# EAGLE design LapCounter (EAGLE 7.6.0)
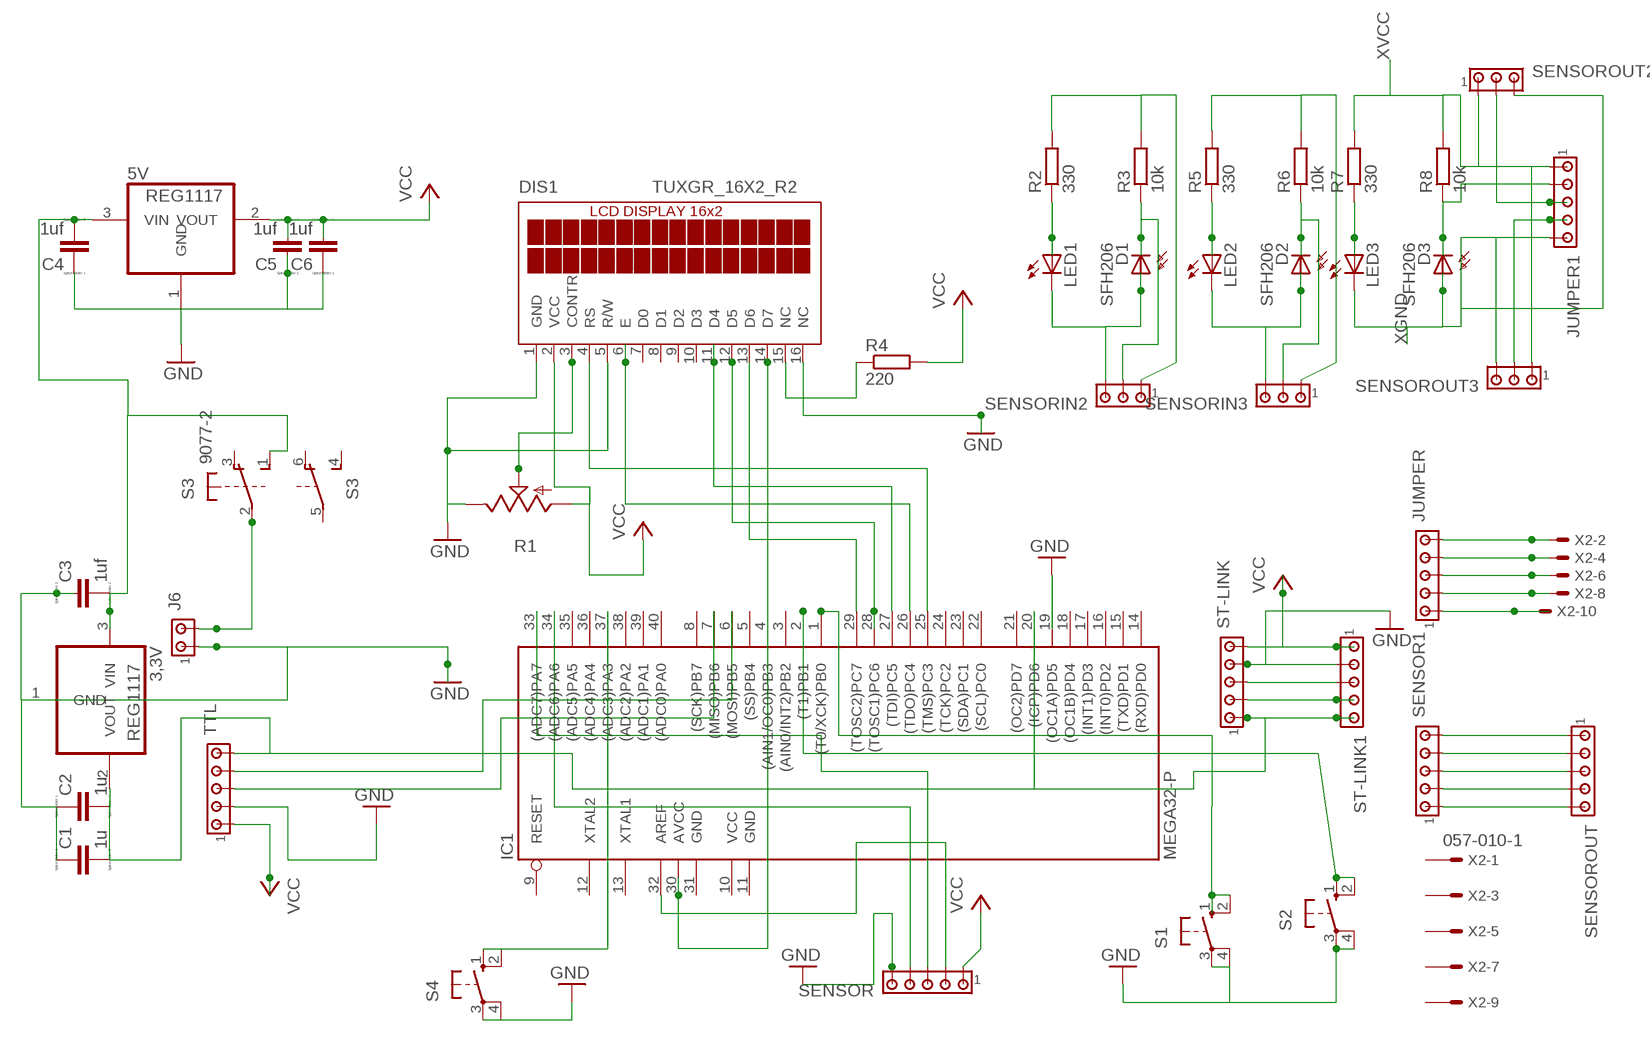
[diagram p0: schematic, sheet 1]

## Parts
3,3V  REG1117  [SOT223]
5V  REG1117  [SOT223]
C1  1u  C  [C0805]
C2  1u  C  [C0805]
C3  1uf  C  [C0805]
C4  1uf  C  [C0805]
C5  1uf  C  [C0805]
C6  1uf  C  [C0805]
D1  SFH206  [SFH206]
D2  SFH206  [SFH206]
D3  SFH206  [SFH206]
DIS1  TUXGR_16X2_R2  [TUXGR_16X2_R2]
IC1  MEGA32-P  [DIL40]
J6  MTA02-100  [10X02MTA]
JUMPER  MTA05-100  [10X05MTA]
JUMPER1  MTA05-100  [10X05MTA]
LED1  LED5MM  [LED5MM]
LED2  LED5MM  [LED5MM]
LED3  LED5MM  [LED5MM]
R1  TRIM_US-CA6V  [CA6V]
R2  330  R-EU_M1206  [M1206]
R3  10k  R-EU_M1206  [M1206]
R4  220  R-EU_M1206  [M1206]
R5  330  R-EU_M1206  [M1206]
R6  10k  R-EU_M1206  [M1206]
R7  330  R-EU_M1206  [M1206]
R8  10k  R-EU_M1206  [M1206]
S1  40-XX  [B3F-40XX]
S2  40-XX  [B3F-40XX]
S3  9077-2  [9077-2]
S4  40-XX  [B3F-40XX]
SENSOR  MTA05-100  [10X05MTA]
SENSOR1  MTA05-100  [10X05MTA]
SENSORIN2  MTA03-100  [10X03MTA]
SENSORIN3  MTA03-100  [10X03MTA]
SENSOROUT  MTA05-100  [10X05MTA]
SENSOROUT2  MTA03-100  [10X03MTA]
SENSOROUT3  MTA03-100  [10X03MTA]
ST-LINK  MTA05-100  [10X05MTA]
ST-LINK1  MTA05-100  [10X05MTA]
TTL  MTA05-100  [10X05MTA]
X2  057-010-1  [057-010-1]

## Nets
5V: J6.2 S3.2(1:P)
GND: 3,3V.1(GND) 5V.1(GND) C1.1 C2.1 C3.1 C4.1 C5.1 C6.1 DIS1.1(GND) DIS1.5(R/W) DIS1.16(NC) J6.1 R1.E S1.3(P) S1.4(P1) S2.3(P) S2.4(P1) S4.3(P) S4.4(P1) SENSOR.5 ST-LINK1.2 ST-LINK.4 TTL.2
N$1: DIS1.4(RS) IC1.25((TMS)PC3)
N$2: SENSOR1.5 SENSOROUT.1
N$3: DIS1.3(CONTR) R1.S
N$4: ST-LINK1.4 ST-LINK.2
N$5: DIS1.15(NC) R4.1
N$6: DIS1.6(E) IC1.26((TDO)PC4)
N$7: DIS1.11(D4) IC1.27((TDI)PC5)
N$8: DIS1.12(D5) IC1.28((TOSC1)PC6)
N$9: DIS1.13(D6) IC1.29((TOSC2)PC7)
N$10: DIS1.14(D7) IC1.30(AVCC)
N$11: ST-LINK1.3 ST-LINK.3
N$12: 3,3V.3(VIN) 5V.3(VIN) C3.2 C4.2 S3.1(1:S)
N$13: JUMPER.5 X2.2
N$14: JUMPER.4 X2.4
N$15: IC1.7((MISO)PB6) TTL.3
N$16: IC1.37((ADC3)PA3) S4.1(S) S4.2(S1)
N$17: IC1.33((ADC7)PA7) SENSOR.3
N$18: IC1.32(AREF) SENSOR.2
N$19: IC1.34((ADC6)PA6) SENSOR.4
N$21: SENSOR1.4 SENSOROUT.2
N$22: SENSOR1.3 SENSOROUT.3
N$23: JUMPER.3 X2.6
N$24: JUMPER.2 X2.8
N$25: IC1.6((MOSI)PB5) TTL.4
N$26: SENSOR1.2 SENSOROUT.4
N$27: JUMPER.1 X2.10
N$28: IC1.1((T0/XCK)PB0) S1.1(S) S1.2(S1)
N$29: IC1.2((T1)PB1) S2.1(S) S2.2(S1)
N$30: 3,3V.2(VOUT) C1.2 C2.2 IC1.20((ICP)PD6) ST-LINK1.5 ST-LINK.1 TTL.5
N$31: SENSOR1.1 SENSOROUT.5
N$70: D1.A LED1.K(C) SENSORIN2.3
N$71: LED1.A R2.1
N$72: D1.K(C) R3.1 SENSORIN2.2
N$73: R2.2 R3.2 SENSORIN2.1
N$74: D2.A LED2.K(C) SENSORIN3.3
N$75: LED2.A R5.1
N$76: D2.K(C) R6.1 SENSORIN3.2
N$77: R5.2 R6.2 SENSORIN3.1
N$79: LED3.A R7.1
N$80: D3.K(C) JUMPER1.2 R8.1
N$86: JUMPER1.4 SENSOROUT3.2
N$87: JUMPER1.3 SENSOROUT2.2
VCC: 5V.2(VOUT) C5.2 C6.2 DIS1.2(VCC) R1.A R4.2 SENSOR.1 ST-LINK1.1 ST-LINK.5 TTL.1
XGND: D3.A JUMPER1.5 LED3.K(C) SENSOROUT2.3 SENSOROUT3.3
XVCC: JUMPER1.1 R7.2 R8.2 SENSOROUT2.1 SENSOROUT3.1
Unconnected: DIS1.7(D0) DIS1.8(D1) DIS1.9(D2) DIS1.10(D3) IC1.3((AIN0/INT2)PB2) IC1.4((AIN1/OC0)PB3) IC1.5((SS)PB4) IC1.8((SCK)PB7) IC1.9(RESET) IC1.12(XTAL2) IC1.13(XTAL1) IC1.14((RXD)PD0) IC1.15((TXD)PD1) IC1.16((INT0)PD2) IC1.17((INT1)PD3) IC1.18((OC1B)PD4) IC1.19((OC1A)PD5) IC1.21((OC2)PD7) IC1.22((SCL)PC0) IC1.23((SDA)PC1) IC1.24((TCK)PC2) IC1.35((ADC5)PA5) IC1.36((ADC4)PA4) IC1.38((ADC2)PA2) IC1.39((ADC1)PA1) IC1.40((ADC0)PA0) S3.3(1:O) S3.4(2:S) S3.5(2:P) S3.6(2:O) X2.1 X2.3 X2.5 X2.7 X2.9

## Power pins joined to a net without a drawn wire
GND: IC1.11(GND) IC1.31(GND)
VCC: IC1.10(VCC)

## Library data of the parts
3,3V 5V = burr-brown:REG1117: 800mA and 1A Low Dropout (LDO) Positive Regulator 1.8V, 2.5V, 2.85V, 3.3V, 5V, and Adj; MPN: REG1117; OC_FARNELL: 1097566; OC_NEWARK: 14P6981
C1-C6 = eagle-ltspice:C: CAPACITOR, European symbol; SPICEMODEL: NONE; SPICEPREFIX: C
D1-D3 = opto-trans-siemens:SFH206: PHOTO DIODE; MPN: SFH206K; OC_FARNELL: 1212741; OC_NEWARK: 01M8807
DIS1 = display-lcd:TUXGR_16X2_R2: Tuxgraphics LCD display 16x2 characters reflective, without background light Source: tuxgr_12x2_r2.pdf; OC_FARNELL: unknown; OC_NEWARK: unknown
IC1 = atmel:MEGA32-P: MICROCONTROLLER 32 Kbytes FLASH 2 Kbytes SRAM 1 Kbytes EEPROM USART 8-channel 10 bit ADC Source: www.atmel.com .. doc2503.pdf; MPN: ATMEGA32-16PU; OC_FARNELL: 1661729; OC_NEWARK: 51P1794
J6 = con-amp:MTA02-100: AMP connector
JUMPER JUMPER1 SENSOR SENSOR1 SENSOROUT ST-LINK ST-LINK1 TTL = con-amp:MTA05-100: AMP connector
LED1-LED3 = led:LED: LED OSRAM: - CHIPLED LG R971, LG N971, LY N971, LG Q971, LY Q971, LO R971, LY R971 LH N974, LH R974 LS Q976, LO Q976, LY Q976 LO Q996 - Hyper CHIPLED LW Q18S LB Q993, LB Q99A, LB R99A - SideLED LS A670, LO A670, LY A670, LG A670, LP A670 LB A673, LV A673, LT A673, LW A673 LH A674 LY A675 LS A676, LA A676, LO A676, LY A676, LW A676 LS A679, LY A679, LG A679 - Hyper Micro SIDELED® LS Y876, LA Y876, LO Y876, LY Y876 LT Y87S - SmartLED LW L88C, LW L88S LB L89C, LB L89S, LG L890 LS L89K, LO L89K, LY L89K LS L896, LA L896, LO L896, LY L896 - TOPLED LS T670, LO T670, LY T670, LG T670, LP T670 LSG T670, LSP T670, LSY T670, LOP T670, LYG T670 LG T671, LOG T671, LSG T671 LB T673, LV T673, LT T673, LW T673 LH T674 LS T676, LA T676, LO T676, LY T676, LB T676, LH T676, LSB T676, LW T676 LB T67C, LV T67C, LT T67C, LS T67K, LO T67K, LY T67K, LW E67C LS E67B, LA E67B, LO E67B, LY E67B, LB E67C, LV E67C, LT E67C LW T67C LS T679, LY T679, LG T679 LS T770, LO T770, LY T770, LG T770, LP T770 LB T773, LV T773, LT T773, LW T773 LH T774 LS E675, LA E675, LY E675, LS T675 LS T776, LA T776, LO T776, LY T776, LB T776 LHGB T686 LT T68C, LB T68C - Hyper Mini TOPLED® LB M676 - Mini TOPLED Santana® LG M470 LS M47K, LO M47K, LY M47K Source: http://www.osram.convergy.de LUXEON: - LUMILED® LXK2-PW12-R00, LXK2-PW12-S00, LXK2-PW14-U00, LXK2-PW14-V00 LXK2-PM12-R00, LXK2-PM12-S00, LXK2-PM14-U00 LXK2-PE12-Q00, LXK2-PE12-R00, LXK2-PE12-S00, LXK2-PE14-T00, LXK2-PE14-U00 LXK2-PB12-K00, LXK2-PB12-L00, LXK2-PB12-M00, LXK2-PB14-N00, LXK2-PB14-P00, LXK2-PB14-Q00 LXK2-PR12-L00, LXK2-PR12-M00, LXK2-PR14-Q00, LXK2-PR14-R00 LXK2-PD12-Q00, LXK2-PD12-R00, LXK2-PD12-S00 LXK2-PH12-R00, LXK2-PH12-S00 LXK2-PL12-P00, LXK2-PL12-Q00, LXK2-PL12-R00 Source: www.luxeon.com KINGBRIGHT: KA-3528ASYC Source: www.kingbright.com
R1 = pot:TRIM_US-: POTENTIOMETER
R2-R8 = rcl:R-EU_: RESISTOR, European symbol
S1 S2 S4 = switch-omron:40-XX: OMRON SWITCH; MF: OMRON COMPONENTS USA; MPN: B3F-4000; OC_FARNELL: 176434; OC_NEWARK: 36K3105
S3 = switch-misc:9077-2: MARQUARDT SWITCH 9077.0200 Distributor: Buerklin <https://www.buerklin.com/default.asp?event=ShowArtikel%2812G2822%29&l=d&jump=ArtNr_12G2822>
SENSORIN2 SENSORIN3 SENSOROUT2 SENSOROUT3 = con-amp:MTA03-100: AMP connector
X2 = con-panduit:057-010-: CONNECTOR 10-pin series 057 contact pc board low profile headers; OC_FARNELL: unknown; OC_NEWARK: unknown

## Board
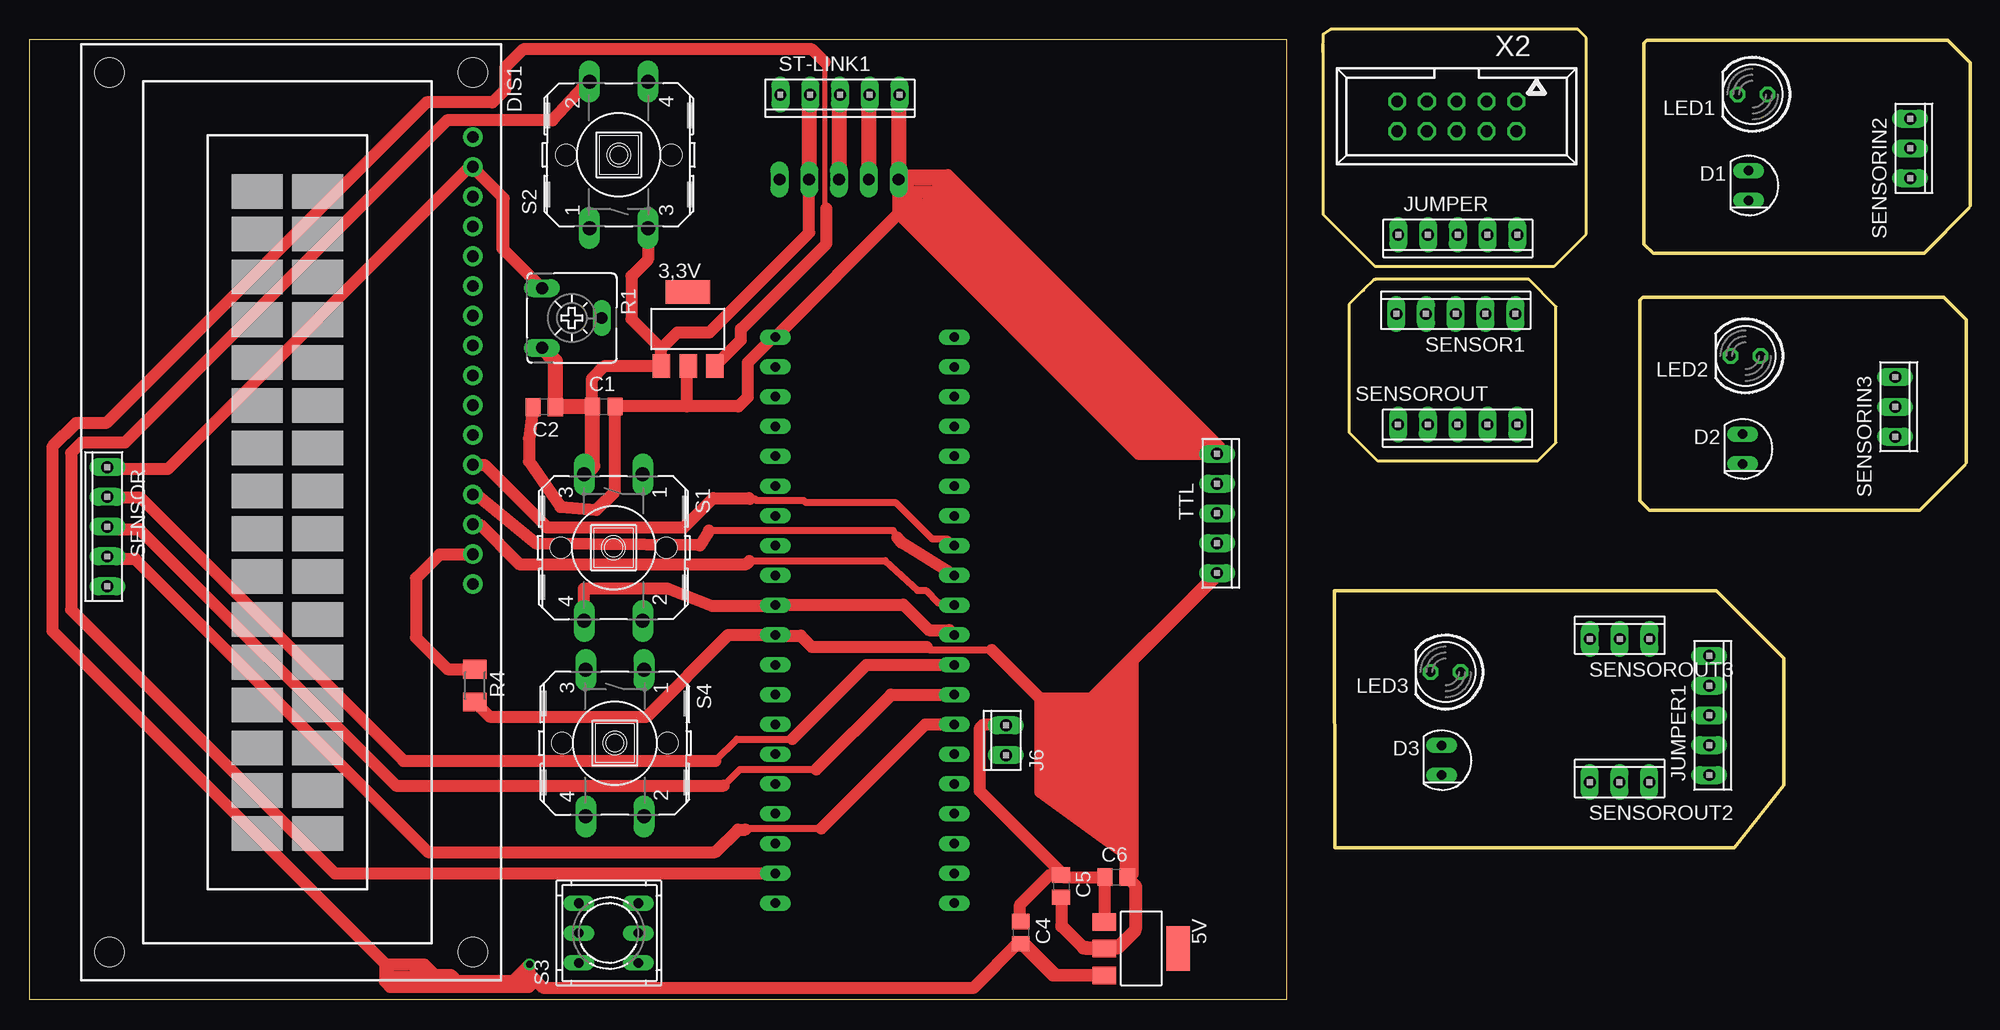
[diagram p1: board, top side]
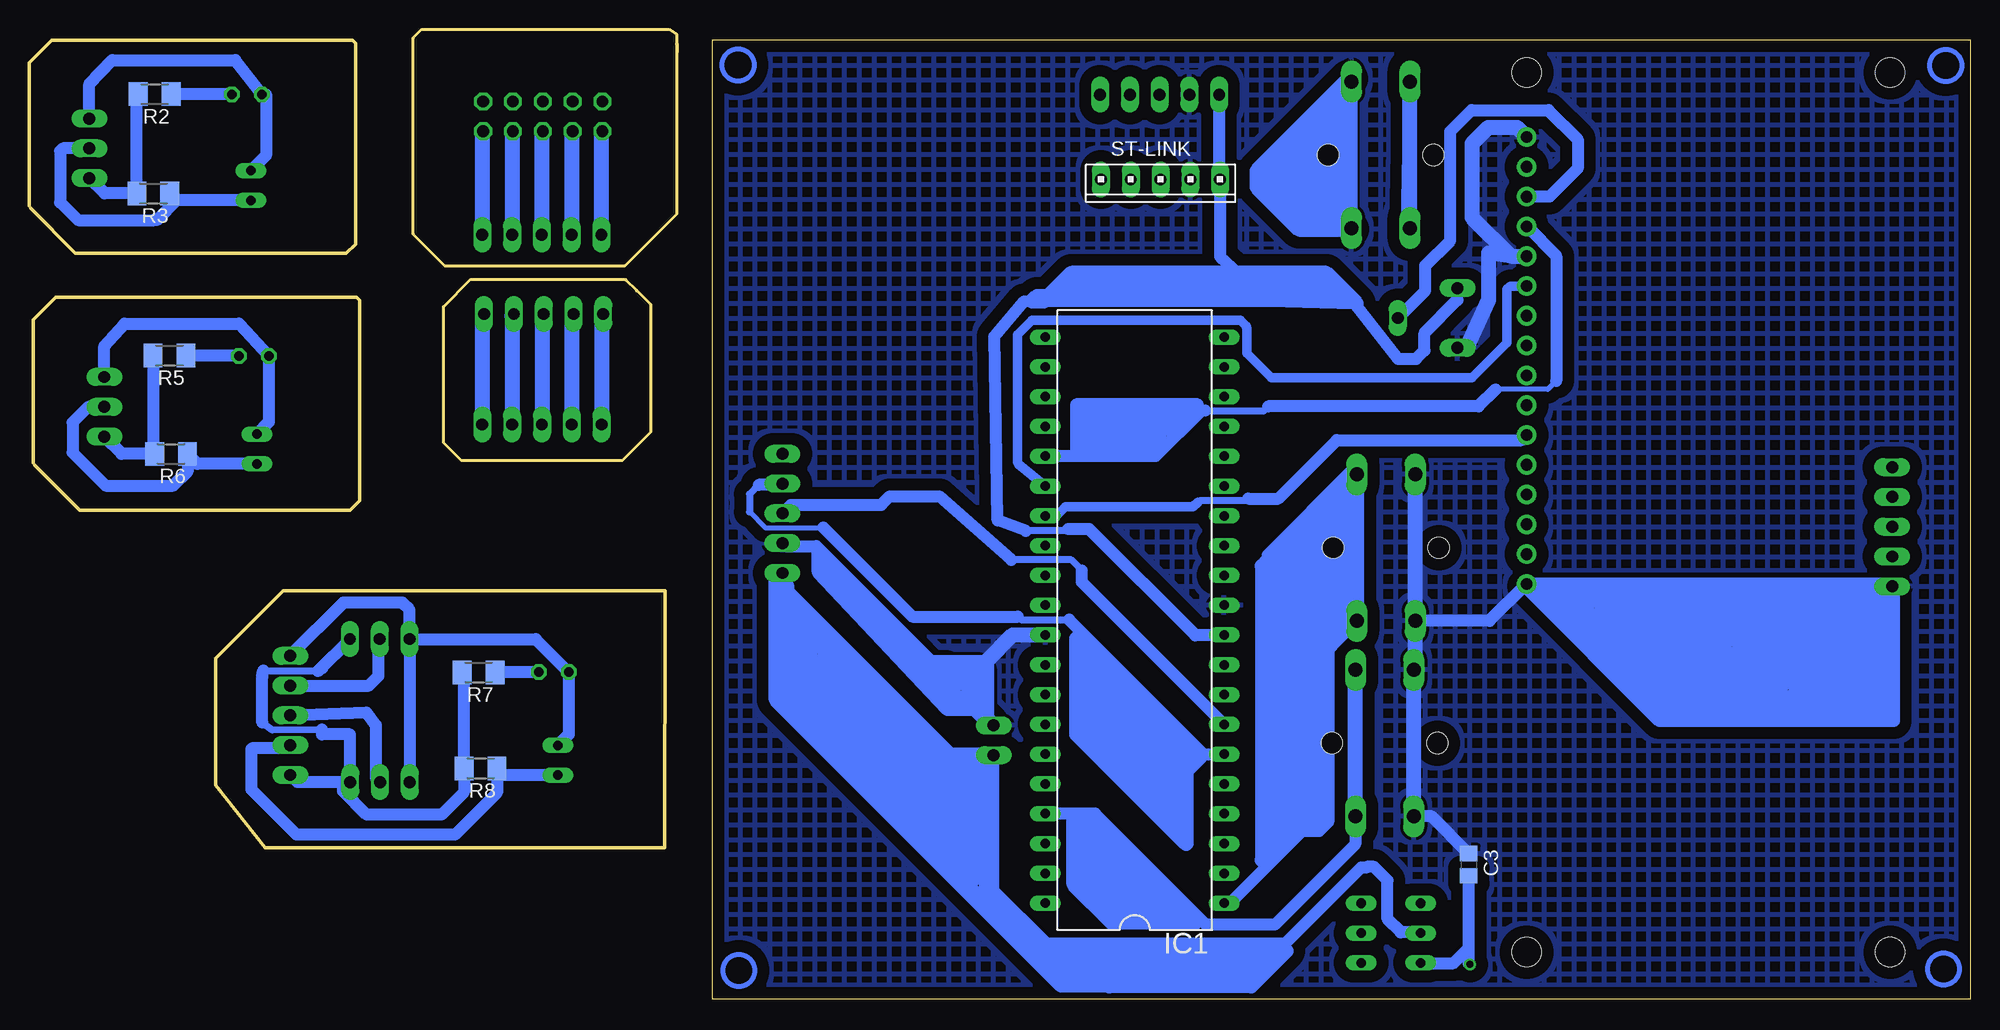
[diagram p2: board, bottom side, seen from below]

Size 165.52 x 82.68 mm. Coordinates in mm from the lower left corner, seen from the top.
Outline: 110.34,81.42 110.34,66.9 114.74,62.5 130.06,62.5 132.78,65.21 132.78,81.94 132.04,82.68 110.96,82.68 110.34,82.26 110.29,80.73
Outline: 113.79,60.48 112.55,59.23 112.55,48.31 114.96,45.9 128.65,45.9 130.19,47.43 130.19,59.03 127.86,61.35 114.81,61.35 114.8,61.37 114.66,61.34 113.79,60.48
Outline: 113.79,60.48 113.72,60.36
Outline: 137.71,81.34 137.71,64.36 138.48,63.59 161.58,63.59 165.42,67.42
Outline: 165.52,67.61 165.52,79.81 163.6,81.72 137.95,81.72 137.69,81.47
Outline: 137.36,59.45 137.36,42.47 138.14,41.69 161.24,41.69 165.07,45.53
Outline: 165.18,45.72 165.18,57.91 163.26,59.83 137.6,59.83 137.35,59.58
Outline: 0,0 107.23,0 107.23,81.8 0,81.8 0,0
Outline: 111.29,34.78 111.29,34.05 111.33,12.89 145.41,12.89 149.63,18.21 149.63,29.06 143.88,34.81 111.32,34.81 111.29,34.78
Copper layers (1*16): Top 0.035mm / dielectric 1.5mm / Bottom 0.035mm
Design rules "default": minimum track width 10mil, minimum drill 24mil, track to track 8mil, track to pad 8mil, pad to pad 8mil, via to via 8mil, smd to smd 8mil, copper to edge 40mil, drill to drill 8mil, minimum pad ring 10mil, minimum via ring 8mil, stop-mask expansion 4mil, vias tented up to drill 0mil, thermal gap 10mil

### Footprints (pad centres in the part's own frame; a part is rotated, then mirrored left to right if it is on the bottom)
SOT223 = smd 1.499 x 2.007: 1 -2.261,-3.15; 2 0.025,-3.15; 3 2.311,-3.15 | smd 3.81 x 2.007: 4 0,3.15
C0805 = smd 1.3 x 1.5: 1 -0.95,0; 2 0.95,0
SFH206 = drill 0.813 long: A 0,-1.27; K 0,1.27
TUXGR_16X2_R2 = drill 1 pad 1.676: 1 -32,15.5; 2 -29.46,15.5; 3 -26.92,15.5; 4 -24.38,15.5; 5 -21.84,15.5; 6 -19.3,15.5; 7 -16.76,15.5; 8 -14.22,15.5; 9 -11.68,15.5; 10 -9.14,15.5; 11 -6.6,15.5; 12 -4.06,15.5; 13 -1.52,15.5; 14 1.02,15.5; 15 3.56,15.5; 16 6.1,15.5 | hole 2.5: -37.5,-15.5; 37.5,-15.5; -37.5,15.5; 37.5,15.5
DIL40 = drill 0.813 long: 1 -24.13,-7.62; 2 -21.59,-7.62; 3 -19.05,-7.62; 4 -16.51,-7.62; 5 -13.97,-7.62; 6 -11.43,-7.62; 7 -8.89,-7.62; 8 -6.35,-7.62; 9 -3.81,-7.62; 10 -1.27,-7.62; 11 1.27,-7.62; 12 3.81,-7.62; 13 6.35,-7.62; 14 8.89,-7.62; 15 11.43,-7.62; 16 13.97,-7.62; 17 16.51,-7.62; 18 19.05,-7.62; 19 21.59,-7.62; 20 24.13,-7.62; 21 24.13,7.62; 22 21.59,7.62; 23 19.05,7.62; 24 16.51,7.62; 25 13.97,7.62; 26 11.43,7.62; 27 8.89,7.62; 28 6.35,7.62; 29 3.81,7.62; 30 1.27,7.62; 31 -1.27,7.62; 32 -3.81,7.62; 33 -6.35,7.62; 34 -8.89,7.62; 35 -11.43,7.62; 36 -13.97,7.62; 37 -16.51,7.62; 38 -19.05,7.62; 39 -21.59,7.62; 40 -24.13,7.62
10X02MTA = drill 1.016 long: 1 1.27,0; 2 -1.27,0
10X05MTA = drill 1.016 long: 1 5.08,0; 2 2.54,0; 3 0,0; 4 -2.54,0; 5 -5.08,0
LED5MM = drill 0.813 octagon: A -1.27,0; K 1.27,0
CA6V = drill 1.016 long: A -2.54,-2.54; E 2.54,-2.54; S 0,2.54
M1206 = smd 1.6 x 2: 1 -1.4,0; 2 1.4,0
B3F-40XX = drill 1.194 long: 1 -6.248,2.489; 2 6.248,2.489; 3 -6.248,-2.489; 4 6.248,-2.489 | hole 1.803: 0,-4.496; 0,4.496
9077-2 = drill 0.813 long: 1 -2.54,2.54; 2 0,2.54; 3 2.54,2.54; 4 -2.54,-2.54; 5 0,-2.54; 6 2.54,-2.54
10X03MTA = drill 1.016 long: 1 2.54,0; 2 0,0; 3 -2.54,0
057-010-1 = drill 1 octagon: 1 -5.08,-1.27; 2 -5.08,1.27; 3 -2.54,-1.27; 4 -2.54,1.27; 5 0,-1.27; 6 0,1.27; 7 2.54,-1.27; 8 2.54,1.27; 9 5.08,-1.27; 10 5.08,1.27

### Placement (x,y rotation side)
3,3V  56.16,57.12 0 top
5V  94.83,4.32 270 top
C1  49,50.53 0 top
C2  43.9,50.46 180 top
C3  42.76,11.46 270 bottom
C4  84.56,5.66 270 top
C5  87.99,9.63 270 top
C6  92.68,10.4 0 top
D1  146.62,69.35 180 top
D2  146.11,46.9 180 top
D3  120.45,20.36 180 top
DIS1  22.33,41.49 270 top
IC1  71.25,32.31 90 bottom
J6  83.29,22.06 90 top
JUMPER  121.82,65.16 180 top
JUMPER1  143.26,24.18 270 top
LED1  146.95,77.14 180 top
LED2  146.35,54.84 180 top
LED3  120.78,27.88 180 top
R1  46.27,58.06 270 top
R2  154.83,77.15 180 bottom
R3  154.94,68.68 180 bottom
R4  38.01,26.72 270 top
R5  153.57,54.86 180 bottom
R6  153.43,46.48 180 bottom
R7  127.2,27.85 180 bottom
R8  127.04,19.67 180 bottom
S1  49.82,38.48 270 top
S2  50.27,71.97 90 top
S3  49.42,5.63 90 top
S4  49.94,21.82 270 top
SENSOR  6.65,40.27 90 top
SENSOR1  121.65,58.41 0 top
SENSORIN2  160.4,72.53 270 top
SENSORIN3  159.12,50.5 270 top
SENSOROUT  121.81,48.98 180 top
SENSOROUT2  135.61,18.49 0 top
SENSOROUT3  135.64,30.7 0 top
ST-LINK  69.05,69.88 180 bottom
ST-LINK1  69.13,77.11 180 top
TTL  101.3,41.4 270 top
X2  121.73,75.26 180 top

### Tracks (layer width: path | path; a pad name or v marks a point on that pad's centre or on a via)
5V
  Bottom 1.016: S3.2 46.93,5.68 48.55,5.68 49.7,6.82 49.7,10.11 50.85,11.26 51.46,11.26 51.51,11.21 51.94,11.21 58.45,4.71 78.79,4.71 83.29,9.21 J6.2
  Bottom 1.27: J6.2 83.31,20.76 87.01,20.76 101.3,35.05
GND
  Top 1.016: C5.1 88.16,10.4 C6.1 91.73,6.63 5V.1 | C4.1 84.51,6.66 84.51,8.04 87.04,10.58 C5.1 | C1.1 47.98,50.6 47.98,52.88 49.07,53.97 3,3V.1 53.87,54 53.87,55.44 | 53.87,55.44 55.27,56.83 58,56.83 66.51,65.34 ST-LINK.4 | S1.4 47.28,35 54.42,35 58.24,33.5 63.55,33.5 IC1.11 63.68,33.63 74.54,33.63 76.71,31.46 78.45,31.46 IC1.31 | J6.1 83.25,23.37 81.33,23.37 81.04,23.08 81.04,17.75 87.99,10.81 C5.1 | 53.87,55.44 51.35,57.96 51.35,61.63 52.76,63.04 S2.3
  Top 1.27: R1.E 44.85,54.4 C2.1 44.93,50.53 C1.1 48.05,45.44 S1.3 | ST-LINK1.2 66.51,77.04 ST-LINK.4
  Bottom 1.016: C3.1 45.93,15.57 S4.4 | S1.4 40.98,32.23 DIS1.16 6.85,35.39 SENSOR.5 | TTL.2 101.04,38.61 98.4,38.61 88.63,28.84 83.86,28.84 | S2.4 S2.3
  Bottom 1.27: J6.1 83.86,23.9 83.86,28.84 81.66,31.04 IC1.31 | DIS1.1 38.63,74.29 41.12,74.29 42.48,72.94 42.48,66.62 39.19,63.33 | 39.19,63.33 DIS1.5 | 39.19,63.33 41.07,63.62 41.07,59.6 42.98,55.52 R1.E | S4.4 S4.3 47.33,28.18 S1.4 S1.3
  pour Bottom (isolate 1.016, hatched): 0.03,0.14 107.23,0.14 107.23,81.9 -0.01,81.83
N$1
  Bottom 0.406: 35.29,52.7 36.02,51.98 40.46,51.98
  Bottom 0.61: 59.88,50.52 60.26,50.13 65.61,50.13
  Bottom 1.016: DIS1.4 35.29,63.34 35.29,52.7 | 40.46,51.98 41.92,50.52 59.88,50.52 | 65.61,50.13 69.47,46.28 IC1.25
N$2
  Bottom 1.27: SENSOR1.5 116.73,58.25 SENSOROUT.1
N$3
  Bottom 1.016: R1.S 46.47,60.4 46.47,62.55 44.35,64.67 44.35,73.98 42.53,75.79 35.97,75.79 33.48,73.3 33.48,70.81 35.88,68.41 DIS1.3
N$4
  Top 1.27: ST-LINK1.4 71.59,77.04 ST-LINK.2
N$5
  Top 1.016: DIS1.15 37.79,37.9 34.99,37.9 32.98,35.89 32.98,30.81 35.67,28.12 R4.1
N$6
  Bottom 0.813: DIS1.6 39.21,60.79 39.5,60.5 39.5,55.94 42.48,52.96 59.59,52.96 61.7,55.07 61.7,57.19 61.72,57.21 61.72,57.35 62.23,57.86 80,57.86 81.24,56.62 81.24,45.77 81.17,45.59 IC1.26
N$7
  Bottom 0.61: 65.87,42.35 65.85,42.35 65.68,42.52 61.7,42.52 61.56,42.66
  Bottom 0.813: IC1.27 77.9,41.2 77.14,41.96 66.27,41.96 65.87,42.35
  Bottom 1.016: 61.56,42.66 59,42.66 54.01,47.65 38.27,47.65 DIS1.11
N$8
  Top 0.61: 61.43,42.65 61.9,42.65 62.01,42.51 66.04,42.51 66.22,42.35 73.86,42.35 76.99,39.23 78.3,39.23 IC1.28
  Top 1.016: DIS1.12 38.82,45.55 44.15,40.22 55.83,40.22 58.32,42.71 61.37,42.71 61.43,42.65
N$9
  Top 0.61: 74,39.37 73.69,39.93 57.95,39.93
  Top 1.016: IC1.29 74.36,38.93 74,39.37 | 57.95,39.93 57.2,38.67 43.24,38.84 38.32,42.85 DIS1.13
N$10
  Top 0.61: 61.42,37.34 61.59,37.34 61.67,37.38 72.99,37.38 75.74,34.84 76.45,34.84 77.51,33.78 78.66,33.78 IC1.30
  Top 1.016: DIS1.14 38.38,40.47 41.77,37.08 61.16,37.08 61.42,37.34
N$11
  Top 1.27: ST-LINK1.3 69.05,77.04 ST-LINK.3
N$12  (via drill 0.6)
  Top 0.406: 67.98,67.41 67.84,67.55 67.84,79.88
  Top 1.016: C4.2 87.26,2.01 5V.3 91.66,2.03 87.59,2.03 84.8,4.83 84.38,4.83 80.49,0.94 43.87,0.94 42.66,2.15 v42.66,2.95 41.24,1.52 36.5,1.52 35.97,2.06 34.57,2.06 33.68,2.95 30.39,2.95 1.96,31.38 1.96,47.07 4,49.11 6.54,49.11 33.88,76.45 39.5,76.45 40.59,77.55 40.59,79.45 42.11,80.97 66.75,80.97 67.84,79.88 | 3,3V.3 60.69,56.2 60.69,57.12 67.98,64.41 67.98,67.41
  Bottom 1.016: S3.1 46.85,3.06 44.06,3.06 42.76,4.36 | 42.76,4.36 C3.2 | v42.66,2.95 42.76,3.05 42.76,4.36
N$13
  Bottom 1.27: X2.2 126.9,73.9 JUMPER.5
N$14
  Bottom 1.27: X2.4 124.36,73.9 JUMPER.4
N$15
  Bottom 0.61: 75.76,36.55 76.66,37.45 81.76,37.45
  Bottom 1.016: IC1.7 75.76,35.55 75.76,36.55 | 81.76,37.45 87.9,42.86 92.15,42.86 92.87,42.14 100.56,42.14 TTL.3
N$16
  Bottom 1.016: S4.2 52.44,15.56 52.44,13.21 59.3,6.35 65.19,6.35 74.64,15.8 IC1.37
  Bottom 1.27: S4.2 S4.1
N$17
  Top 0.61: 59.22,18.19 60.6,19.57 67.09,19.57
  Top 1.016: SENSOR.3 6.86,40.07 9.39,40.07 31.27,18.19 59.22,18.19 | 67.09,19.57 73.48,25.96 IC1.33
N$18
  Top 0.61: 58.5,20.31 60.35,22.16 65.05,22.16
  Top 1.016: SENSOR.2 6.71,42.76 9.46,42.76 31.92,20.31 58.5,20.31 | 65.05,22.16 71.39,28.5 IC1.32
N$19
  Top 0.61: 61.06,14.45 61.15,14.54 67.55,14.54
  Top 1.016: SENSOR.4 6.83,37.55 8.99,37.55 34.02,12.52 58.5,12.52 60.43,14.45 61.06,14.45 | 67.55,14.54 76.43,23.42 IC1.34
N$21
  Bottom 1.27: SENSOR1.4 119.27,58.25 SENSOROUT.2
N$22
  Bottom 1.27: SENSOR1.3 121.81,58.25 SENSOROUT.3
N$23
  Bottom 1.27: X2.6 121.82,73.9 JUMPER.3
N$24
  Bottom 1.27: X2.8 119.28,73.9 JUMPER.2
N$25
  Bottom 0.406: 104.11,41.53 102.78,40.2 97.8,40.2
  Bottom 0.61: 103.33,43.84 104.11,43.05 104.11,41.53 | 81.22,32.6 80.96,32.35 76.85,32.35
  Bottom 1.016: TTL.4 101.4,43.84 103.33,43.84 | 97.8,40.2 90.21,32.6 81.22,32.6 | 76.85,32.35 65.38,20.88 IC1.6
N$26
  Bottom 1.27: SENSOR1.2 124.35,58.25 SENSOROUT.4
N$27
  Bottom 1.27: X2.10 116.74,73.9 JUMPER.1
N$28
  Bottom 1.016: S1.2 54.74,29.81 54.74,15.1 55.52,14.31 56.98,14.31 63.12,8.18 IC1.1
  Bottom 1.27: S1.2 S1.1
N$29  (via drill 0.6)
  Top 1.016: v47.79,78.37 44.59,74.92 35.62,74.92 8.14,47.43 4.43,47.43 3.56,46.56 3.56,33.21 26.05,10.72 IC1.2
  Bottom 1.016: S2.1 48.02,65.96 v47.79,78.37
  Bottom 1.27: S2.1 S2.2
N$30
  Top 1.016: IC1.20 74.13,66.94 | 74.13,66.94 ST-LINK.1 | IC1.20 63.59,56.48 | 56.07,50.53 60.46,50.53 61.28,51.35 61.28,54.28 63.44,56.44 IC1.20 | 56.07,50.53 C1.2 49.95,43.3 48.35,41.71 45.3,41.96 42.62,45.83 42.61,47.77 C2.2 | 3,3V.2 56.07,53.86 56.07,50.53 | 74.13,66.94 94.59,46.48 TTL.5
  Top 1.27: ST-LINK1.5 74.13,77.04 ST-LINK.1
N$31
  Bottom 1.27: SENSOR1.1 126.89,58.25 SENSOROUT.5
N$32
  Bottom 1.27: 52.97,78.45 60.81,70.61 60.81,69.21 57.23,65.63 52.91,65.63 53.7,66.42 53.7,77.05 59.78,70.97 59.78,68.67 57.77,66.66 54.5,66.66 54.67,66.84 54.67,75.11 58.56,71.22 58.56,68.67 57.52,67.63 55.52,67.63 55.4,67.75 55.4,73.1 57.47,71.03 57.47,68.61 57.4,68.54 56.07,68.54 56.25,68.72 56.25,71.34
N$33
  Bottom 1.27: 52.36,59.31 54.91,61.86 76.66,61.86 79.02,59.5 80,59.5 79.58,59.92 53.95,59.92 54.86,60.83 76.9,60.83
N$34
  Bottom 1.27: 52.55,45.03 59.78,37.81 59.78,37.68 54.14,32.04 52.55,32.04 53.34,32.83 53.34,43.15 58.38,38.11 58.38,37.57 54.06,33.25 53.82,33.25 54.24,33.67 54.24,40.78 53.89,41.13 53.89,41.52 57.23,38.18 57.23,37.5 55.09,35.37 | 55.09,35.37 55.09,35.32 | 55.09,35.37 55.09,39.38 56.18,38.29 56.18,36.54
N$35
  Bottom 1.27: 59.96,37.32 60.38,36.91 60.38,11.87 56.92,15.33 55.7,15.33 55.52,15.51 55.52,29.18 54.55,30.16 54.55,31.31 59.65,36.41 59.65,36.54 59.52,36.41 59.52,12.9 56.49,15.94 56.49,29.06 58.62,26.92 58.62,14.72 57.47,15.87 57.47,27.18 58.01,27.72 58.93,27.72 58.56,28.09 58.56,34.65 55.64,31.72 55.64,29.43 56.49,30.28 56.49,31.91 57.16,32.59 57.71,32.59 57.58,32.46 57.58,28.94 56.92,29.6 56.92,29.84
N$36
  Bottom 1.27: 65.96,6.64 66.08,6.53 73.19,6.53 76.42,9.75 76.42,15.7 67.86,7.14 67.3,7.14 74.78,14.62 74.78,14.91 75.44,14.25 75.44,9.74 72.95,7.25 69.24,7.25 74.52,12.53 74.52,12.72 74.17,12.37 74.17,9.38 72.71,7.92 71.07,7.92 73.13,9.98 73.56,9.98
N$37
  Bottom 1.27: 65.72,20.61 66.88,19.46 | 66.88,19.46 66.88,19.04 | 66.88,19.04 66.88,13.27 76.17,22.57 76.17,30.76 66.88,21.46 66.88,19.46 | 66.88,19.04 67.42,18.49 67.42,14.36 75.26,22.2 75.26,29.12 67.91,21.77 67.91,17.03 68.4,16.53 68.4,15.21 68.95,15.76 68.95,21.41 74.52,26.99 74.52,27.36 74.04,26.87 74.04,22.11 69.82,17.89 69.51,17.89 70.19,18.58 70.19,21.4 73.11,24.32 73.46,24.32 73.08,23.94 73.08,21.59 71.79,20.31 70.43,20.31 72.21,22.08 72.63,22.08
N$38
  Bottom 1.27: 58.34,4.11 61.33,1.13 73.42,1.13 73.48,1.19 77.5,1.19 101.83,25.53 101.83,36.19 100.95,35.32 100.95,25.04 77.98,2.07 61.54,2.07 59.58,4.04 59.58,4.19 59.65,4.11 78.23,4.11 77.42,3.3 77.42,2.15 76.62,2.95 61.33,2.95
N$39
  Bottom 1.27: 78.66,3.9 83.98,9.22 83.98,9.3 83.91,9.37 83.91,20.52 85,19.43 85,10.17 100.08,25.25 100.08,32.92 87.17,20.01 85.72,20.01 86.02,19.72 86.02,11.4 98.92,24.31 98.92,30.58 99.06,30.72 99.06,31.09 86.97,19 86.97,13.23 98.04,24.31 98.04,28.77 87.91,18.63 87.91,14.76 97.17,24.02 97.17,26.72 88.94,18.49 88.94,16.43 96.44,23.94 96.44,24.68 89.88,18.11 89.88,18.05
N$40
  Bottom 1.27: 83.62,23.51 84.86,24.75 87.19,24.75 98.16,36.41 98.16,38.1 86.08,25.34 85,25.34 84.63,25.7 84.63,27.89 84.71,27.96 87.26,27.96 87.4,28.1 88.06,28.1 86.97,27.01 85.43,27.01 85.43,25.77
N$41
  Bottom 1.016: 65.86,50.7 76.25,50.7 76.25,46.84 69.05,46.84 69.05,49.89 75.41,49.89 75.41,47.64 69.74,47.64 69.74,47.88 69.89,47.88 69.89,49.2 74.6,49.2 74.6,48.23 70.22,48.23 70.22,48.56
N$42
  Bottom 1.016: 65.24,50.16 68.28,50.16 68.28,48.42 67.37,48.42 67.37,49.53 67.16,49.53 67.16,49.59
N$43
  Bottom 1.016: 6.6,34.73 6.51,34.73 6.51,23.7 26.5,23.7 37.99,35.18
N$44
  Bottom 1.016: 7.19,34.7 7.19,24.64 7.35,24.47 26.11,24.47 36.49,34.85 8.12,34.85 7.86,34.59 7.86,25.06 8.28,24.64 24.98,24.64 34.77,34.43 8.64,34.43 8.33,34.12 8.33,25.88 8.75,25.46 24.41,25.46 24.61,25.67 25.08,25.67 33.32,33.91 9.31,33.91 8.53,33.13 8.53,27.08 9.78,25.83 23.94,25.83 31.51,33.4
N$45
  Bottom 1.016: 9.22,32.88 30.48,32.88 30.73,33.13
N$46
  Bottom 1.016: 8.65,32.11 29.34,32.11 29.39,32.16
N$47
  Bottom 1.016: 8.43,31.37 28.35,31.37 28.4,31.32 29.44,31.32 29.54,31.22
N$48
  Bottom 1.016: 27.67,30.91 27.52,30.91 22.9,26.29
N$49
  Bottom 1.016: 9.27,30.86 9.27,27.16 10.25,26.19 10.25,30.81 10.2,30.86 10.87,30.86 11.14,30.59 11.14,26.14 11.19,26.09 11.7,26.09 12.22,26.61 12.22,30.64
N$50
  Bottom 1.016: 11.7,26.81 11.7,30.49 11.59,30.59
N$51
  Bottom 1.016: 13.06,31.06 13.06,26.44 13.36,26.14
N$52
  Bottom 1.016: 13.93,31.11 13.93,26.97 14.35,26.56
N$53
  Bottom 1.016: 14.92,31.06 14.92,26.81 15.07,26.66
N$54
  Bottom 1.016: 15.54,30.96 15.54,27.11 16.32,26.34
N$55
  Bottom 1.016: 16.47,30.91 16.47,27.16 17.25,26.39 17.25,30.71 17.09,30.86 17.77,30.86 18.29,30.34 18.29,26.81 18.14,26.66 22.02,26.66 26.43,31.06 19.16,31.06 18.54,30.44
N$56
  Bottom 1.016: 19.3,30.66 19.3,27.34 19.11,27.15 21.34,27.15 24.75,30.57 20.14,30.57 19.81,30.24 19.81,27.89 20.19,27.51 20.52,27.51 23.05,30.04 21.04,30.04 20.23,29.22 20.23,28.47 20.56,28.14 20.56,28.51 21.42,29.37
N$57
  Bottom 1.016: 28.21,30.7 27.83,30.7 21.97,24.84
N$58
  Top 1.016: 74.5,70.26 78.33,70.26 101.47,47.12 95.31,47.12 74.24,68.19 74.24,68.85 75.27,69.88 77.67,69.88 99.92,47.62 96.09,47.62 74.88,68.83 77.47,68.83 77.72,68.58 77.94,68.58 98.25,48.27 96.75,48.27 76.7,68.33 77.17,68.33 96.57,48.92
N$59
  Top 1.016: 77.6,69.1 77.48,69.1 77.34,68.96
N$60
  Top 1.016: 94.12,10.64 94.12,28.89 101.22,35.99
N$61
  Top 1.016: 86.54,24.1 90.34,24.1 93.62,27.39
N$62
  Top 1.016: 86.83,24.85 90.41,24.85 90.56,24.7
N$63
  Top 1.016: 93.26,26.28 93.26,13.04 93.33,12.97
N$64
  Top 1.016: 86.75,23.43 86.75,18.5 88.25,17
N$65
  Top 1.016: 92.51,14.02 92.51,24.85 91.99,25.37 92.29,25.68 92.29,14.62 91.91,14.24
N$66
  Top 1.016: 91.54,14.76 91.54,24.03 91.24,24.33 91.24,24.47 91.54,24.78
N$67
  Top 1.016: 87.66,23.81 87.66,18.34 90.49,15.51 90.49,15.29 90.94,14.83 90.94,23.28 90.56,23.66 88.71,23.66 88.25,23.2 88.25,18.87 90.56,16.56 90.56,22.85 90.27,23.14 89.23,23.14 89,22.91 89,19.32 90.12,18.2 90.12,21.93 89.45,22.61 89.45,19.48 89.75,19.18
N$68
  Top 1.016: 88.48,16.41 88.7,16.41 88.85,16.56
N$69
  Top 1.016: 30.33,2.97 30.33,1.49 30.77,1.04 42.58,1.04 42.71,1.17 42.65,1.17 42.28,1.54 31.33,1.54 30.95,1.92 32.7,1.92 33.01,2.22 33.5,2.22
N$70
  Bottom 1.016: D1.A 145.33,71.92 145.33,77.14 LED1.K 147.94,80.05 158.45,80.05 160.4,78 SENSORIN2.3
N$71
  Bottom 1.016: LED1.A 153.43,77.14 R2.1
N$72
  Bottom 1.016: D1.K 152.94,68.08 | 152.94,68.08 R3.1 | SENSORIN2.2 162.65,72.53 162.89,72.29 162.89,67.93 161.37,66.41 154.85,66.41 154.8,66.46 154.57,66.46 152.94,68.08
N$73
  Bottom 1.016: R2.2 156.34,77.04 R3.2 159.09,68.68 SENSORIN2.1
N$74
  Bottom 1.016: D2.A 145.08,49.2 LED2.K 147.64,57.58 157.39,57.58 159.12,55.66 SENSORIN3.3
N$75
  Bottom 1.016: LED2.A 152.14,54.84 R5.1
N$76
  Bottom 1.016: D2.K 151.18,45.63 R6.1 152.03,44.97 153.24,43.76 159,43.76 161.82,46.58 161.82,49.16 160.49,50.49 SENSORIN3.2
N$77
  Bottom 1.016: R5.2 154.97,46.62 R6.2 157.65,46.48 SENSORIN3.1
N$79
  Bottom 1.016: LED3.A 125.78,27.88 R7.1
N$80
  Bottom 1.016: D3.K 125.05,19.09 R8.1 125.64,17.59 129.22,14.01 142.72,14.01 146.56,17.84 146.56,21.32 146.47,21.41 143.48,21.41 JUMPER1.2
N$86
  Bottom 1.016: JUMPER1.4 136.58,26.72 135.74,27.56 135.74,30.59 SENSOROUT3.2
N$87
  Bottom 1.016: JUMPER1.3 136.79,24.45 135.97,23.35 135.97,18.85 SENSOROUT2.2
VCC
  Top 0.61: 76.53,30.02 76.78,29.77 82.07,29.77
  Top 1.016: C6.2 94.3,9.74 94.3,5.75 92.84,4.29 5V.2 90.03,4.29 88.01,6.31 88.01,8.65 C5.2 88.02,8.64 88.02,6.18 89.89,4.32 90.09,4.32 90.2,4.42 92.77,4.42 94.4,6.04 94.4,9.58 93.59,10.39 93.48,12.39 86.21,17.67 86.21,25.63 | R1.A 40.46,63.87 | 40.46,63.87 40.46,68.26 40.36,68.36 | 40.36,68.36 37.83,70.9 | 37.83,70.9 DIS1.2 | 64.13,31.04 IC1.10 | 40.46,63.87 40.36,63.97 40.36,68.36 | 37.83,70.9 37.82,70.9 37.53,70.9 11.8,45.17 6.48,45.17 | 6.48,45.17 6.03,45.17 | SENSOR.1 6.48,45.17 | R4.2 39.25,24.08 52.67,24.08 59.63,31.04 IC1.10 | IC1.10 63.69,30.97 65.77,30.97 66.73,30.02 76.53,30.02 | 82.07,29.77 86.21,25.63 | 86.21,25.63 90.6,25.63 TTL.1
  Bottom 0.61: 76.91,40.07 77.01,39.92 80.53,39.92
  Bottom 1.016: IC1.10 63.65,31.01 66.09,31.01 75.15,40.07 76.91,40.07 | 80.53,39.92 82.94,40.8 83.22,56.5 80.68,59.47 59.89,59.53 | 59.89,59.53 52.5,59.32 48.79,54.58 47.27,54.58 46.55,55.31 46.55,56.78 43.73,59.6 R1.A | ST-LINK1.1 64.05,69.95 ST-LINK.5 63.97,63.31 59.89,59.53
XGND
  Bottom 1.016: D3.A 119.51,22.57 LED3.K 122.33,30.7 SENSOROUT3.3 | SENSOROUT3.3 133.1,33.18 133.71,33.79 138.72,33.79 JUMPER1.5 | SENSOROUT3.3 133.1,18.52 SENSOROUT2.3
XVCC
  Bottom 0.61: 140.55,22.96 144.79,22.94 145.66,23.56 | 145.55,27.99 140.83,27.99 140.53,28.23
  Bottom 1.016: R7.2 128.44,27.69 R8.2 128.44,17.65 130.37,15.72 136.74,15.72 138.77,17.75 138.77,18.4 138.68,18.49 | 138.68,18.49 SENSOROUT2.1 138.18,18.52 138.18,22.57 140.56,22.57 140.55,22.96 | 138.68,18.49 142.65,18.49 JUMPER1.1 | 145.66,23.56 145.66,27.44 145.55,27.99 | 140.53,28.23 140.92,27.95 SENSOROUT3.1
(copper drawn outside any net)
  shapes: Bottom circle x4